# Altium schematic sheet ARDINO_UNO.SchDoc
size 500 x 350 mm; SheetNumber: 1; SheetTotal: 1
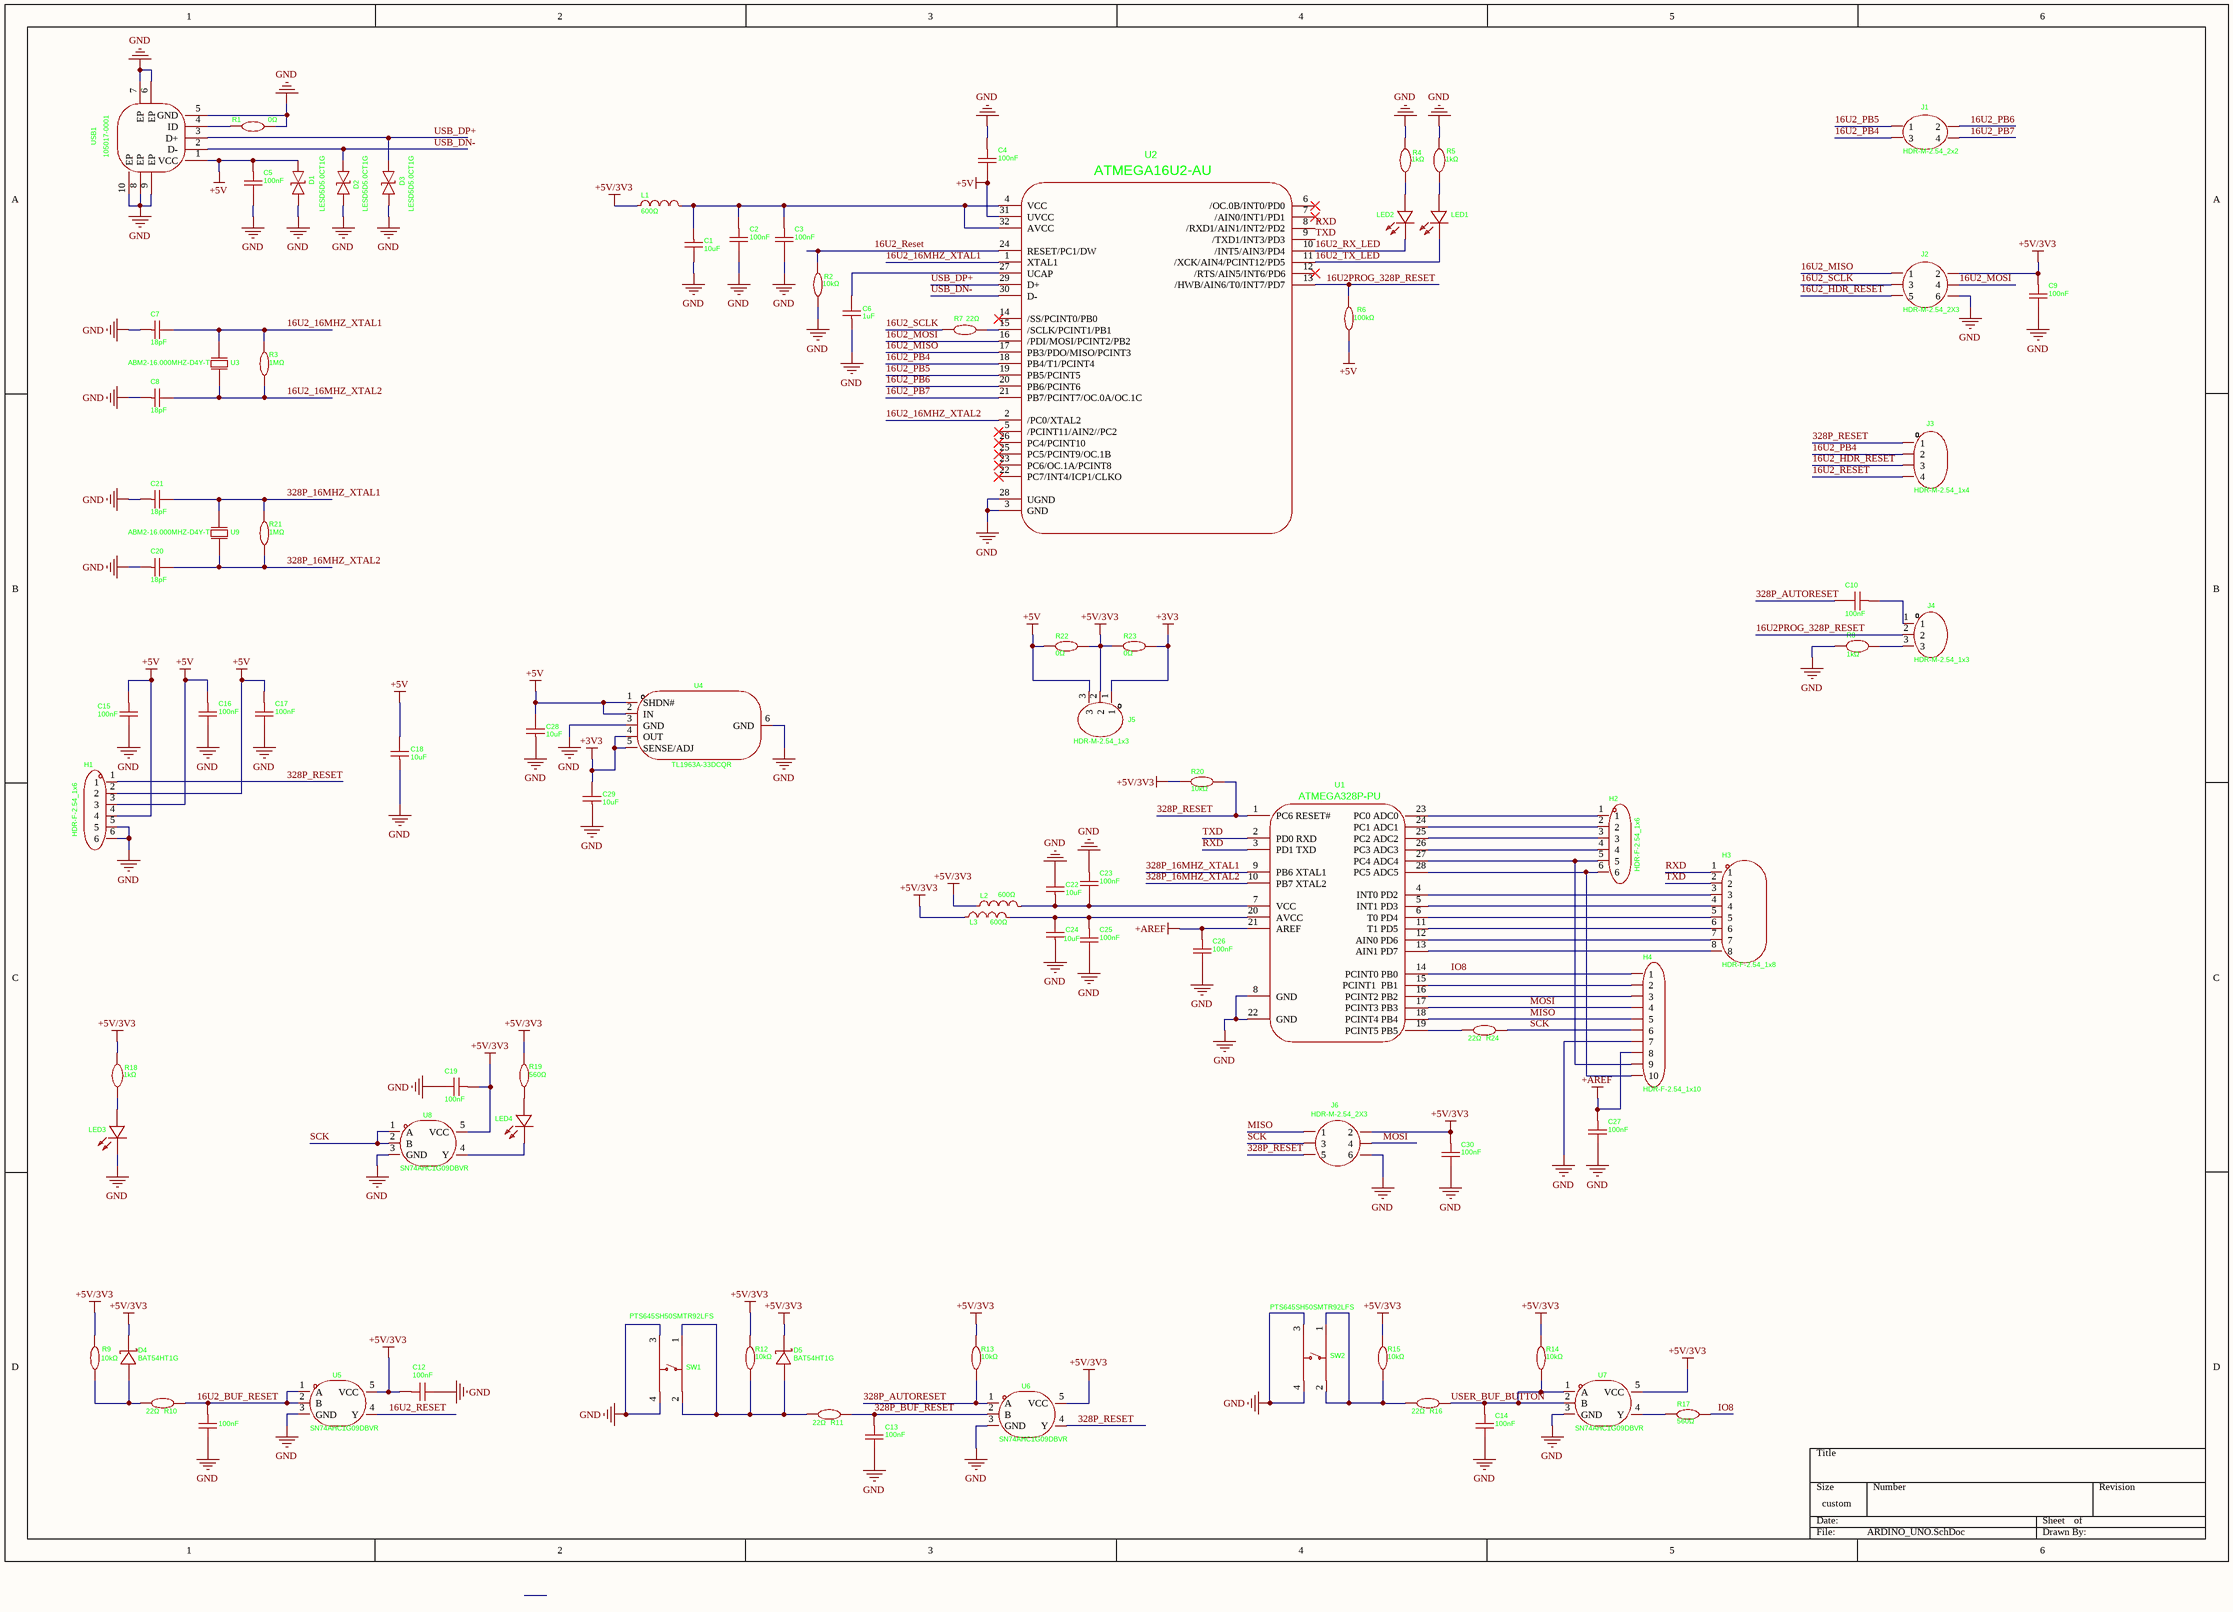
[diagram p0: ARDINO_UNO.SchDoc]

## Parts
?  100nF  [C0603-100nF]
C1  10uF  [C1206-10uF]
C2  100nF  [C0603-100nF]
C3  100nF  [C0603-100nF]
C4  100nF  [C0603-100nF]
C5  100nF  [C0603-100nF]
C6  1uF  [C0805-1uF]
C7  18pF  [C0402-18pF]
C8  18pF  [C0402-18pF]
C9  100nF  [C0603-100nF]
C10  100nF  [C0603-100nF]
C12  100nF  [C0603-100nF]
C13  100nF  [C0603-100nF]
C14  100nF  [C0603-100nF]
C15  100nF  [C0603-100nF]
C16  100nF  [C0603-100nF]
C17  100nF  [C0603-100nF]
C18  10uF  [C1206-10uF]
C19  100nF  [C0603-100nF]
C20  18pF  [C0402-18pF]
C21  18pF  [C0402-18pF]
C22  10uF  [C1206-10uF]
C23  100nF  [C0603-100nF]
C24  10uF  [C1206-10uF]
C25  100nF  [C0603-100nF]
C26  100nF  [C0603-100nF]
C27  100nF  [C0603-100nF]
C28  10uF  [C1206-10uF]
C29  10uF  [C1206-10uF]
C30  100nF  [C0603-100nF]
D1  LESD5D5.0CT1G  [SOD-523_L1.2-W0.8-LS1.6-BI]
D2  LESD5D5.0CT1G  [SOD-523_L1.2-W0.8-LS1.6-BI]
D3  LESD5D5.0CT1G  [SOD-523_L1.2-W0.8-LS1.6-BI]
D4  BAT54HT1G  [DIODE-SOD-323_L1.8-W1.3-LS2.5-RD]
D5  BAT54HT1G  [DIODE-SOD-323_L1.8-W1.3-LS2.5-RD]
H1  HDR-F-2.54_1x6  [HDR-TH_6P-P2.54-V-F]
H2  HDR-F-2.54_1x6  [HDR-TH_6P-P2.54-V-F]
H3  HDR-F-2.54_1x8  [HDR-TH_8P-P2.54-V_A2541HWV-8P]
H4  HDR-F-2.54_1x10  [HDR-TH_10P-P2.54-V-F]
J1  HDR-M-2.54_2x2  [HDR-TH_4P-P2.54-V-M-R2-C2-S2.54-1]
J2  HDR-M-2.54_2X3  [HDR-TH_6P-P2.54-V-M-R2-C3-S2.54-1]
J3  HDR-M-2.54_1x4  [HDR-TH_4P-P2.54-V-M]
J4  HDR-M-2.54_1x3  [HDR-TH_3P-P2.54-V-M-1]
J5  HDR-M-2.54_1x3  [HDR-TH_3P-P2.54-V-M-1]
J6  HDR-M-2.54_2X3  [HDR-TH_6P-P2.54-V-M-R2-C3-S2.54-1]
L1  600Ω  [L0805-600ohm]
L2  600Ω  [L0805-600ohm]
L3  600Ω  [L0805-600ohm]
LED1  KT-0805G  [LED0805-R-RD]  (value not drawn)
LED2  KT-0805G  [LED0805-R-RD]  (value not drawn)
LED3  KT-0805G  [LED0805-R-RD]  (value not drawn)
LED4  KT-0805G  [LED0805-R-RD]  (value not drawn)
R1  0Ω  [R0402-0 ohm]
R2  10kΩ  [R0402-10Kohm]
R3  1MΩ  [R0402-1M ohm]
R4  1kΩ  [R0805-1kohm]
R5  1kΩ  [R0805-1kohm]
R6  100kΩ  [R0805-100kohm]
R7  22Ω  [R0402-22 OHM]
R8  1kΩ  [R0805-1kohm]
R9  10kΩ  [R0402-10Kohm]
R10  22Ω  [R0402-22 OHM]
R11  22Ω  [R0402-22 OHM]
R12  10kΩ  [R0402-10Kohm]
R13  10kΩ  [R0402-10Kohm]
R14  10kΩ  [R0402-10Kohm]
R15  10kΩ  [R0402-10Kohm]
R16  22Ω  [R0402-22 OHM]
R17  560Ω  [R0402-560 OHM]
R18  1kΩ  [R0805-1kohm]
R19  560Ω  [R0402-560 OHM]
R20  10kΩ  [R0402-10Kohm]
R21  1MΩ  [R0402-1M ohm]
R22  0Ω  [R0402-0 ohm]
R23  0Ω  [R0402-0 ohm]
R24  22Ω  [R0402-22 OHM]
SW1  PTS645SH50SMTR92LFS  [KEY-SMD_4P-L6.0-W6.0-P4.50-LS9.0]
SW2  PTS645SH50SMTR92LFS  [KEY-SMD_4P-L6.0-W6.0-P4.50-LS9.0]
U1  ATMEGA328P-PU  [DIP-28_L34.6-W7.3-P2.54-LS10.2-BL]
U2  ATMEGA16U2-AU  [TQFP-32_L7.0-W7.0-P0.80-LS9.0-TL]
U3  ABM2-16.000MHZ-D4Y-T  [CRYSTAL-SMD_L8.0-W4.5]
U4  TL1963A-33DCQR  [SOT-223-6_L6.5-W3.5-P1.27-LS7.0-BR]
U5  SN74AHC1G09DBVR  [SOT-23-5_L2.9-W1.6-P0.95-LS2.8-BL]
U6  SN74AHC1G09DBVR  [SOT-23-5_L2.9-W1.6-P0.95-LS2.8-BL]
U7  SN74AHC1G09DBVR  [SOT-23-5_L2.9-W1.6-P0.95-LS2.8-BL]
U8  SN74AHC1G09DBVR  [SOT-23-5_L2.9-W1.6-P0.95-LS2.8-BL]
U9  ABM2-16.000MHZ-D4Y-T  [CRYSTAL-SMD_L8.0-W4.5]
USB1  105017-0001  [MICRO-USB-SMD_105017-0001]

## Nets
+3V3: C29.2 J5.1 R23.2 U4.4(OUT) U4.5(SENSE/ADJ)
+5V: C4.1 C5.2 C15.2 C16.2 C17.2 C18.2 C28.2 D1.2 H1.2 H1.3 H1.4 J5.3 R6.1 R22.1 U2.31(UVCC) U4.1(SHDN#) U4.2(IN) USB1.1(VCC)
+5V/3V3: C9.2 C12.2 C19.2 C30.2 D4.1(K) D5.1(K) J2.2 J5.2 J6.2 L1.1 L2.1 L3.1 R9.1 R12.2 R13.2 R14.2 R15.1 R18.2 R19.2 R20.2 R22.2 R23.1 U5.5(VCC) U6.5(VCC) U7.5(VCC) U8.5(VCC)
+AREF: C26.2 C27.2 H4.8 U1.21(AREF)
GND: ?.1 C1.2 C2.1 C3.1 C4.2 C5.1 C6.1 C7.1 C8.1 C9.1 C12.1 C13.1 C14.1 C15.1 C16.1 C17.1 C18.1 C19.1 C20.1 C21.1 C22.2 C23.2 C24.1 C25.1 C26.1 C27.1 C28.1 C29.1 C30.1 D1.1 D2.1 D3.1 H1.5 H1.6 H4.7 J2.6 J6.6 LED3.2(K) R1.2 R2.1 R4.2 R5.2 R8.1 SW1.3 SW1.4 SW2.3 SW2.4 U1.8(GND) U1.22(GND) U2.3(GND) U2.28(UGND) U4.3(GND) U4.6(GND) U5.3(GND) U6.3(GND) U7.3(GND) U8.3(GND) USB1.5(GND) USB1.6(EP) USB1.7(EP) USB1.8(EP) USB1.9(EP) USB1.10(EP)
16U2_16MHZ_XTAL1: C7.2 R3.2 U2.1(XTAL1) U3.2(OSC2)
16U2_16MHZ_XTAL2: C8.2 R3.1 U2.2(/PC0/XTAL2) U3.1(OSC1)
16U2_BUF_RESET: ?.2 R10.2 U5.1(A) U5.2(B)
16U2_HDR_RESET: J2.5 J3.3
16U2_MISO: J2.1 U2.17(PB3/PDO/MISO/PCINT3)
16U2_MOSI: J2.4 U2.16(/PDI/MOSI/PCINT2/PB2)
16U2_PB4: J1.3 J3.2 U2.18(PB4/T1/PCINT4)
16U2_PB5: J1.1 U2.19(PB5/PCINT5)
16U2_PB6: J1.2 U2.20(PB6/PCINT6)
16U2_PB7: J1.4 U2.21(PB7/PCINT7/OC.0A/OC.1C)
16U2_Reset: J3.4 R2.2 U2.24(RESET/PC1/DW) U5.4(Y)
16U2_RX_LED: LED2.2(K) U2.10(/INT5/AIN3/PD4)
16U2_SCLK: J2.3 R7.1
16U2_TX_LED: LED1.2(K) U2.11(/XCK/AIN4/PCINT12/PD5)
16U2PROG_328P_RESET: J4.2 R6.2 U2.13(/HWB/AIN6/T0/INT7/PD7)
328P_16MHZ_XTAL1: C21.2 R21.2 U1.9(PB6_XTAL1) U9.2(OSC2)
328P_16MHZ_XTAL2: C20.2 R21.1 U1.10(PB7_XTAL2) U9.1(OSC1)
328P_AUTORESET: C10.1 R13.1 U6.1(A)
328P_BUF_RESET: C13.2 R11.2 U6.2(B)
328P_RESET: H1.1 J3.1 J6.5 R20.1 U1.1(PC6_RESET#) U6.4(Y)
IO8: H4.1 R17.2 U1.14(PCINT0_PB0)
MISO: H4.5 J6.1 U1.18(PCINT4_PB4)
MOSI: H4.4 J6.4 U1.17(PCINT3_PB3)
RXD: H3.1 U1.3(PD1_TXD) U2.8(/RXD1/AIN1/INT2/PD2)
SCK: H4.6 J6.3 R24.2 U8.1(A) U8.2(B)
TXD: H3.2 U1.2(PD0_RXD) U2.9(/TXD1/INT3/PD3)
USB_DN-: D2.2 U2.30(D-) USB1.2(D-)
USB_DP+: D3.2 U2.29(D+) USB1.3(D+)
USER_BUF_BUTTON: C14.2 R14.1 R16.2 U7.1(A) U7.2(B)
NetC1_1: C1.1 C2.2 C3.2 L1.2 U2.4(VCC) U2.32(AVCC)
NetC6_2: C6.2 U2.27(UCAP)
NetC10_2: C10.2 J4.1
NetC22_1: C22.1 C23.1 L2.2 U1.7(VCC)
NetC24_2: C24.2 C25.2 L3.2 U1.20(AVCC)
NetD4_2: D4.2(A) R9.2 R10.1
NetD5_2: D5.2(A) R11.1 R12.1 SW1.1 SW1.2
NetH2_1: H2.1 U1.23(PC0_ADC0)
NetH2_2: H2.2 U1.24(PC1_ADC1)
NetH2_3: H2.3 U1.25(PC2_ADC2)
NetH2_4: H2.4 U1.26(PC3_ADC3)
NetH2_5: H2.5 H4.9 U1.27(PC4_ADC4)
NetH2_6: H2.6 H4.10 U1.28(PC5_ADC5)
NetH3_3: H3.3 U1.4(INT0_PD2)
NetH3_4: H3.4 U1.5(INT1_PD3)
NetH3_5: H3.5 U1.6(T0_PD4)
NetH3_6: H3.6 U1.11(T1_PD5)
NetH3_7: H3.7 U1.12(AIN0_PD6)
NetH3_8: H3.8 U1.13(AIN1_PD7)
NetH4_2: H4.2 U1.15(PCINT1__PB1)
NetH4_3: H4.3 U1.16(PCINT2_PB2)
NetJ4_3: J4.3 R8.2
NetLED1_1: LED1.1(A) R5.1
NetLED2_1: LED2.1(A) R4.1
NetLED3_1: LED3.1(A) R18.1
NetLED4_1: LED4.1(A) R19.1
NetLED4_2: LED4.2(K) U8.4(Y)
NetR1_1: R1.1 USB1.4(ID)
NetR7_2: R7.2 U2.15(/SCLK/PCINT1/PB1)
NetR15_2: R15.2 R16.1 SW2.1 SW2.2
NetR17_1: R17.1 U7.4(Y)
NetR24_1: R24.1 U1.19(PCINT5_PB5)

Not connected (* = marked no-connect by the designer): U2 5(/PCINT11/AIN2//PC2)* 6(/OC.0B/INT0/PD0)* 7(/AIN0/INT1/PD1)* 12(/RTS/AIN5/INT6/PD6)* 14(/SS/PCINT0/PB0)* 22(PC7/INT4/ICP1/CLKO)* 23(PC6/OC.1A/PCINT8)* 25(PC5/PCINT9/OC.1B)* 26(PC4/PCINT10)*

## Library data of the parts
? C2-C5 C9 C10 C12-C17 C19 C23 C25-C27 C30 = CC0603KRX7R9BB104: 50V 100nF X7R ±10% 0603 Multilayer Ceramic Capacitors MLCC - SMD/SMT ROHS; Manufacturer: YAGEO(国巨); Add into BOM: yes; Symbol: CC0603KRX7R9BB104; Device: CC0603KRX7R9BB104; LCSC Part Name: 100nF ±10% 50V; Supplier Part: C14663; Manufacturer Part: CC0603KRX7R9BB104; Supplier Footprint: 0603; JLCPCB Part Class: Basic Part; Datasheet: https://atta.szlcsc.com/upload/public/pdf/source/20180910/C282072_33301C7F631E79921B82A8DAC6BCC5B3.pdf; Supplier: LCSC; Convert to PCB: yes; Value: 100nF; Tolerance: ±10%
C1 C18 C22 C24 C28 C29 = CL31A106KBHNNNE: 50V 10uF X5R ±10% 1206 Multilayer Ceramic Capacitors MLCC - SMD/SMT ROHS; Manufacturer: SAMSUNG(三星); Add into BOM: yes; Symbol: CL31A106KBHNNNE; Device: CL31A106KBHNNNE; LCSC Part Name: 10uF ±10% 50V; Supplier Part: C13585; Manufacturer Part: CL31A106KBHNNNE; Supplier Footprint: 1206; JLCPCB Part Class: Basic Part; Datasheet: https://atta.szlcsc.com/upload/public/pdf/source/20160218/1457707763339.pdf; Supplier: LCSC; Convert to PCB: yes; Value: 10uF; Tolerance: ±10%
C6 = CL21B105KBFNNNE: 50V 1uF X7R ±10% 0805 Multilayer Ceramic Capacitors MLCC - SMD/SMT ROHS; Manufacturer: SAMSUNG(三星); Add into BOM: yes; Symbol: CL21B105KBFNNNE; Device: CL21B105KBFNNNE; LCSC Part Name: 1uF ±10% 50V; Supplier Part: C28323; Manufacturer Part: CL21B105KBFNNNE; Supplier Footprint: 0805; JLCPCB Part Class: Basic Part; Datasheet: https://atta.szlcsc.com/upload/public/pdf/source/20160218/1457707763339.pdf; Supplier: LCSC; Convert to PCB: yes; Value: 1uF; Tolerance: ±10%
C7 C8 C20 C21 = CC0402JRNPO9BN180: 50V 18pF NP0 ±5% 0402 Multilayer Ceramic Capacitors MLCC - SMD/SMT ROHS; Manufacturer: YAGEO(国巨); Add into BOM: yes; Symbol: CC0402JRNPO9BN180; Device: CC0402JRNPO9BN180; LCSC Part Name: 18pF ±5% 50V; Supplier Part: C106202; Manufacturer Part: CC0402JRNPO9BN180; Supplier Footprint: 0402; JLCPCB Part Class: Extended Part; Datasheet: https://atta.szlcsc.com/upload/public/pdf/source/20170505/1493957838062.pdf; Supplier: LCSC; Convert to PCB: yes; Value: 18pF; Tolerance: ±5%
D1-D3 = LESD5D5.0CT1G: 9.4A 18.6V 5.6V Bidirectional 5V SOD-523 ESD and Surge Protection (TVS/ESD) ROHS; Manufacturer: LRC(乐山无线电); Add into BOM: yes; Symbol: LESD5D5.0CT1G; Device: LESD5D5.0CT1G; LCSC Part Name: 双向ESD; Supplier Part: C383211; Manufacturer Part: LESD5D5.0CT1G; Supplier Footprint: SOD-523; JLCPCB Part Class: Extended Part; Datasheet: https://atta.szlcsc.com/upload/public/pdf/source/20190807/C383211_633DF4B4E2C161403226E5235FE33A1C.pdf; Supplier: LCSC; Convert to PCB: yes; polarity: Bidirectional; Reverse Stand-Off Voltage (Vrwm): 5V; Maximum Clamping Voltage: 18.6V; Peak Pulse Current (Ipp): 9.4A; Breakdown Voltage: 5.6V; Type: ESD
D4 D5 = BAT54HT1G: 30V 800mV@100mA 200mA SOD-323 Schottky Diodes ROHS; Manufacturer: onsemi(安森美); Add into BOM: yes; Reverse Leakage Current (Ir): 2uA@25V; Symbol: BAT54HT1G; Device: BAT54HT1G; LCSC Part Name: 电压:30V 电流:200mA; Supplier Part: C21107; Manufacturer Part: BAT54HT1G; Supplier Footprint: SOD-323; JLCPCB Part Class: Extended Part; Datasheet: https://atta.szlcsc.com/upload/public/pdf/source/20131023/1457706657764.pdf; Supplier: LCSC; Convert to PCB: yes; Forward Voltage (Vf@If): 800mV@100mA; Reverse Voltage (Vr): 30V; Rectified Current: 200mA
H1 H2 = HDR-F-2.54_1x6: 2.54mm Single Row 6P Direct Insert 1x6P Plugin,P=2.54mm Female Headers ROHS; Manufacturer: BOOMELE(博穆精密); Symbol: Header-Female-2.54_1x6; Device: 2.54-1*6P母; Add into BOM: yes; LCSC Part Name: 间距:2.54mm 1x6P 直插; Supplier Part: C40877; Manufacturer Part: 2.54-1*6P母; Supplier Footprint: 插件,P=2.54mm; JLCPCB Part Class: Extended Part; Datasheet: https://atta.szlcsc.com/upload/public/pdf/source/20210301/C2718488_F4427B881E42CAA8DDB0B1C12B3A522C.pdf; Supplier: LCSC; Convert to PCB: yes; Holes Structure: 1x6P; Pitch: 2.54mm; Row Spacing: -; Mounting Type: Straight; Number of Rows: Plugin; Number of Holes: 6P; Insulation Height: -; Contact Material: -; Contact Plating: -
H3 = A2541HWV-8P: 2.54mm 3A Single Row Gold -40℃~+105℃ 250V 8P Brass Direct Insert 1x8P Top 8.5mm Square Hole Plugin,P=2.54mm Female Headers ROHS; Manufacturer: CJT(长江连接器); Add into BOM: yes; PIN Length: 3.2mm; Symbol: A2541HWV-8P; Device: A2541HWV-8P; LCSC Part Name: 1x8P 间距:2.54mm 直插; Supplier Part: C225505; Manufacturer Part: A2541HWV-8P; Supplier Footprint: 插件,P=2.54mm; JLCPCB Part Class: Extended Part; Datasheet: https://atta.szlcsc.com/upload/public/pdf/source/20180724/C239359_48B1BC0CA1B4E4396A63955AAFD15564.pdf; Supplier: LCSC; Convert to PCB: yes; Holes Structure: 1x8P; Pitch: 2.54mm; Row Spacing: -; Circular Hole / Square Hole: Square Hole; Mounting Type: Direct Insert; Number of Rows: Single Row; Number of Positions: 8P; Current Rating: 3A; Voltage Rating (Max): 250V; Holes Direction: Top; Insulation Height: 8.5mm; Contact Material: Brass; Contact Plating: Gold; Operating Temperature: -40℃~+105℃
H4 = 2.54-1*10P母: 2.54mm Single Row 10P Direct Insert 1x10P Plugin,P=2.54mm Female Headers ROHS; Manufacturer: BOOMELE(博穆精密); Symbol: Header-Female-2.54_1x10; Add into BOM: yes; Device: 2.54-1*10P母; LCSC Part Name: 间距:2.54mm 1x10P 直插; Supplier Part: C35445; Manufacturer Part: 2.54-1*10P母; Supplier Footprint: 插件,P=2.54mm; JLCPCB Part Class: Extended Part; Datasheet: https://atta.szlcsc.com/upload/public/pdf/source/20200813/C35445_A4147CED0A1C9075722E373C7771E928.pdf; Supplier: LCSC; Convert to PCB: yes; Holes Structure: 1x10P; Pitch: 2.54mm; Row Spacing: -; Mounting Type: Straight; Number of Rows: Plugin; Number of Holes: 10P; Insulation Height: -; Contact Material: -; Contact Plating: -
J1 = 2.54-2*2P针: Straight 4P 2.54mm Double Row Black 2.54mm Plugin,P=2.54mm Pin Headers ROHS; Manufacturer: BOOMELE(博穆精密); Symbol: Header-Male-2.54_2x2; Add into BOM: yes; Device: 2.54-2*2P针; LCSC Part Name: 间距:2.54mm 直插; Supplier Part: C66690; Manufacturer Part: 2.54-2*2P针; Supplier Footprint: 插件,P=2.54mm; JLCPCB Part Class: Extended Part; Datasheet: https://atta.szlcsc.com/upload/public/pdf/source/20221201/C605E3BE9C0F7226363017EFD1BDE852.pdf; Supplier: LCSC; Convert to PCB: yes; Pin Structure: -; Pitch: 2.54mm; Row Spacing: 2.54mm; Circluar Pins/Square Pins: -; Mounting Type: Straight; Number of Rows: Double Row; Number of Pins: 4P; Current Rating: -; Voltage Rating (Max): -; Length of Mating Pin: -; Insulation Height: -; Contact Material: -; Contact Plating: -; Color: Black
J2 J6 = 2.54-2*3P针: Straight 6P 2.54mm Double Row Black Plugin,P=2.54mm Pin Headers ROHS; Manufacturer: BOOMELE(博穆精密); Symbol: Header-Male-2.54_2x3; Add into BOM: yes; Device: 2.54-2*3P针; LCSC Part Name: 间距:2.54mm 直插; Supplier Part: C65114; Manufacturer Part: 2.54-2*3P针; Supplier Footprint: 插件,P=2.54mm; JLCPCB Part Class: Extended Part; Supplier: LCSC; Convert to PCB: yes; Pin Structure: -; Pitch: 2.54mm; Row Spacing: -; Circluar Pins/Square Pins: -; Mounting Type: Straight; Number of Rows: Double Row; Number of Pins: 6P; Current Rating: -; Voltage Rating (Max): -; Length of Mating Pin: -; Insulation Height: -; Contact Material: -; Contact Plating: -; Color: Black
J3 = HDR-M-2.54_1x4: Straight 2.54mm 4P 6mm -40℃~+105℃ 3mm 2.54mm Single Row Black Brass 1x4P Plugin,P=2.54mm Pin Headers ROHS; Manufacturer: Ckmtw(灿科盟); Symbol: Header-Male-2.54_1x4; Device: B-2100S04P-A110; Add into BOM: yes; LCSC Part Name: 1x4P 间距:2.54mm 直插; Supplier Part: C124378; Manufacturer Part: B-2100S04P-A110; Supplier Footprint: 插件,P=2.54mm; JLCPCB Part Class: Extended Part; Datasheet: https://atta.szlcsc.com/upload/public/pdf/source/20170821/C124381_1503303309126901535.pdf; Supplier: LCSC; Convert to PCB: yes; Pin Structure: 1x4P; Pitch: 2.54mm; Row Spacing: -; Circluar Pins/Square Pins: -; Mounting Type: Straight; Number of Rows: Single Row; Number of Pins: 4P; Current Rating: -; Voltage Rating (Max): -; Length of Mating Pin: 6mm; Insulation Height: 2.54mm; Length of End Connection Pin: 3mm; Contact Material: Brass; Contact Plating: -; Operating Temperature: -40℃~+105℃; Color: Black
J4 J5 = HDR-M-2.54_1x3: Tin 3A Straight Policy 2.54mm 3P -65℃~+125℃ 2.54mm Single Row Black Phosphor Bronze Plugin,P=2.54mm Pin Headers ROHS; Manufacturer: Amphenol; Symbol: 77311-102-03LF; Add into BOM: yes; Device: 77311-102-03LF; LCSC Part Name: 间距:2.54mm 方针 直插; Supplier Part: C180248; Manufacturer Part: 77311-102-03LF; Supplier Footprint: 插件,P=2.54mm; JLCPCB Part Class: Extended Part; Datasheet: https://atta.szlcsc.com/upload/public/pdf/source/20180628/C213450_5021AFFAB06BCF705334CA5527F304F1.pdf; Supplier: LCSC; Convert to PCB: yes; Pin Structure: -; Pitch: 2.54mm; Row Spacing: -; Circluar Pins/Square Pins: Policy; Mounting Type: Straight; Number of Rows: Single Row; Number of Pins: 3P; Current Rating: 3A; Voltage Rating (Max): -; Length of Mating Pin: -; Insulation Height: 2.54mm; Contact Material: Phosphor Bronze; Contact Plating: Tin; Operating Temperature: -65℃~+125℃; Color: Black
L1-L3 = MPZ2012S601AT000: 100mΩ ±25% 600Ω@100MHz 0805 Ferrite Beads ROHS; Manufacturer: TDK; Add into BOM: yes; Current Rating: 2A; Circuits: 1; Symbol: MPZ2012S601AT000; Device: MPZ2012S601AT000; LCSC Part Name: 单路 0805磁珠 阻抗600Ω@100MHz; Supplier Part: C21519; Manufacturer Part: MPZ2012S601AT000; Supplier Footprint: 0805; JLCPCB Part Class: Extended Part; Datasheet: https://atta.szlcsc.com/upload/public/pdf/source/20141219/1457707252380.pdf; Supplier: LCSC; Convert to PCB: yes; Impedance @ Frequency: 600Ω@100MHz; Tolerance: ±25%; DC Resistance: 100mΩ
LED1-LED4 = KT-0805G: Emerald 0805 LED Indication - Discrete ROHS; Manufacturer: KENTO; Symbol: 0805G (Green); Add into BOM: yes; Device: KT-0805G; LCSC Part Name: 0805 翠绿 高亮; Supplier Part: C2297; Manufacturer Part: KT-0805G; Supplier Footprint: 0805; JLCPCB Part Class: Basic Part; Datasheet: https://atta.szlcsc.com/upload/public/pdf/source/20170209/1486607340485.pdf; Supplier: LCSC; Convert to PCB: yes; Lamp Holder Type: -; Emitted Color: Emerald; Forward Voltage (VF): -; Power Dissipation: -; Forward Current: -; Dominant Wavelength: -; Peak Wavelength: -; Diode Configuration: -; Lens Color: -; Color Temperature: -; Luminous Intensity: -; Viewing Angle: -; Mounting Sytle: -; Operating Temperature: -
R1 R22 R23 = RC0402FR-070RL: 62.5mW Thick Film Resistors 50V ±1% 0Ω 0402 Chip Resistor - Surface Mount ROHS; Manufacturer: YAGEO(国巨); Add into BOM: yes; Symbol: RC0402FR-070RL; Device: RC0402FR-070RL; LCSC Part Name: 厚膜电阻 0Ω ±1% 62.5mW; Supplier Part: C106231; Manufacturer Part: RC0402FR-070RL; Supplier Footprint: 0402; JLCPCB Part Class: Extended Part; Datasheet: https://atta.szlcsc.com/upload/public/pdf/source/20180927/C295883_E8D83085EA81BD7DE0B2B681138C15EE.pdf; Supplier: LCSC; Convert to PCB: yes; Type: Thick Film Resistors; Value: 0Ω; Tolerance: ±1%; Temperature Coefficient: -; Operating Temperature Range: -55℃~+155℃
R2 R9 R12-R15 R20 = RC0402FR-0710KL: 62.5mW Thick Film Resistors 50V ±100ppm/℃ ±1% 10kΩ 0402 Chip Resistor - Surface Mount ROHS; Manufacturer: YAGEO(国巨); Add into BOM: yes; Symbol: RC0402FR-0710KL; Device: RC0402FR-0710KL; LCSC Part Name: 厚膜电阻 10kΩ ±1% 62.5mW; Supplier Part: C60490; Manufacturer Part: RC0402FR-0710KL; Supplier Footprint: 0402; JLCPCB Part Class: Extended Part; Datasheet: https://atta.szlcsc.com/upload/public/pdf/source/20170925/C131467_1506321478108990263.pdf; Supplier: LCSC; Convert to PCB: yes; Type: Thick Film Resistors; Value: 10kΩ; Tolerance: ±1%; Temperature Coefficient: ±100ppm/℃; Operating Temperature Range: -55℃~+155℃
R3 R21 = RC0402FR-071ML: 62.5mW Thick Film Resistors 50V ±100ppm/℃ ±1% 1MΩ 0402 Chip Resistor - Surface Mount ROHS; Manufacturer: YAGEO(国巨); Add into BOM: yes; Symbol: RC0402FR-071ML; Device: RC0402FR-071ML; LCSC Part Name: 厚膜电阻 1MΩ ±1% 62.5mW; Supplier Part: C138033; Manufacturer Part: RC0402FR-071ML; Supplier Footprint: 0402; JLCPCB Part Class: Extended Part; Datasheet: https://atta.szlcsc.com/upload/public/pdf/source/20181009/C309620_DA5935B6E1D48212CB7A533FE518B3C2.pdf; Supplier: LCSC; Convert to PCB: yes; Type: Thick Film Resistors; Value: 1MΩ; Tolerance: ±1%; Temperature Coefficient: ±100ppm/℃; Operating Temperature Range: -55℃~+155℃
R4 R5 R8 R18 = FRC0805J102 TS: 0.125W Thick Film Resistors 150V ±100ppm/℃ ±5% 1kΩ 0805 Chip Resistor - Surface Mount ROHS; Manufacturer: FOJAN(富捷); Add into BOM: yes; Symbol: FRC0805J102 TS; Device: FRC0805J102 TS; LCSC Part Name: 1kΩ ±5% 125mW 厚膜电阻; Supplier Part: C2907295; Manufacturer Part: FRC0805J102 TS; Supplier Footprint: 0805; JLCPCB Part Class: Extended Part; Datasheet: https://atta.szlcsc.com/upload/public/pdf/source/20211221/925EC7D7225764EE0046F22065062C87.pdf; Supplier: LCSC; Convert to PCB: yes; Type: Thick Film Resistors; Value: 1kΩ; Tolerance: ±5%; Temperature Coefficient: ±100ppm/℃; Operating Temperature Range: -55℃~+155℃
R6 = 0805W8F1003T5E_1: 0.125W Thick Film Resistors 150V ±100ppm/℃ ±1% 100kΩ 0805 Chip Resistor - Surface Mount ROHS; Manufacturer: UNI-ROYAL(厚声); Symbol: 0805W8F1003T5E_C149504; Add into BOM: yes; Device: 0805W8F1003T5E; LCSC Part Name: 100kΩ ±1% 125mW 厚膜电阻; Supplier Part: C149504; Manufacturer Part: 0805W8F1003T5E; Supplier Footprint: 0805; JLCPCB Part Class: Basic Part; Datasheet: https://atta.szlcsc.com/upload/public/pdf/source/20200306/C422600_1E6D84923E4A46A82E41ADD87F860B5C.pdf; Supplier: LCSC; Convert to PCB: yes; Type: Thick Film Resistors; Value: 100kΩ; Tolerance: ±1%; Temperature Coefficient: ±100ppm/℃; Operating Temperature Range: -55℃~+155℃
R7 R10 R11 R16 R24 = RC0402FR-0722RL: 62.5mW Thick Film Resistors 50V ±100ppm/℃ ±1% 22Ω 0402 Chip Resistor - Surface Mount ROHS; Manufacturer: YAGEO(国巨); Add into BOM: yes; Symbol: RC0402FR-0722RL; Device: RC0402FR-0722RL; LCSC Part Name: 厚膜电阻 22Ω ±1% 62.5mW; Supplier Part: C114765; Manufacturer Part: RC0402FR-0722RL; Supplier Footprint: 0402; JLCPCB Part Class: Extended Part; Datasheet: https://atta.szlcsc.com/upload/public/pdf/source/20180821/C275644_0D56F95EFF785E7D9A1FEF436B37DA78.pdf; Supplier: LCSC; Convert to PCB: yes; Type: Thick Film Resistors; Value: 22Ω; Tolerance: ±1%; Temperature Coefficient: ±100ppm/℃; Operating Temperature Range: -55℃~+155℃
R17 R19 = RC0402FR-07560RL: 62.5mW Thick Film Resistors 50V ±100ppm/℃ ±1% 560Ω 0402 Chip Resistor - Surface Mount ROHS; Manufacturer: YAGEO(国巨); Add into BOM: yes; Symbol: RC0402FR-07560RL; Device: RC0402FR-07560RL; LCSC Part Name: 厚膜电阻 560Ω ±1% 62.5mW; Supplier Part: C163460; Manufacturer Part: RC0402FR-07560RL; Supplier Footprint: 0402; JLCPCB Part Class: Extended Part; Datasheet: https://atta.szlcsc.com/upload/public/pdf/source/20181009/C309620_DA5935B6E1D48212CB7A533FE518B3C2.pdf; Supplier: LCSC; Convert to PCB: yes; Type: Thick Film Resistors; Value: 560Ω; Tolerance: ±1%; Temperature Coefficient: ±100ppm/℃; Operating Temperature Range: -55℃~+155℃
SW1 SW2 = PTS645SH50SMTR92LFS: 6mm 5mm Round Button 50mA Standing paste 6mm SPST 200gf 12V SMD,6x6mm Tactile Switches ROHS; Manufacturer: C&K; Add into BOM: yes; Pin Style: Gullwing; Symbol: PTS645SH50SMTR92LFS; Device: PTS645SH50SMTR92LFS; LCSC Part Name: 6*6*5mm 立贴 轻触开关; Supplier Part: C221869; Manufacturer Part: PTS645SH50SMTR92LFS; Supplier Footprint: SMD,6x6mm; JLCPCB Part Class: Extended Part; Datasheet: https://atta.szlcsc.com/upload/public/pdf/source/20190108/C285530_E89B379DE8DD14E424006A6061D0203A.pdf; Supplier: LCSC; Convert to PCB: yes; Circuit: SPST; Actuator Style: Round Button; Operating Force: 200gf; Mounting Style: Standing paste; Switch Length: 6mm; Switch Width: 6mm; Switch Height: 5mm; Contact Current: 50mA; Voltage Rating (DC): 12V; With Lamp: -; Mechanical Life: -; Operating Temperature: -40℃~+85℃
U1 = ATMEGA328P-PU: AVR 20MHz DIP-28-300mil Microcontrollers (MCU/MPU/SOC) ROHS; Manufacturer: MICROCHIP(美国微芯); Add into BOM: yes; Program Storage Size: 32KB; RAM Size: 2KB; GPIO Ports Number: 23; Operating Voltage Range: 1.8V~5.5V; Program Memory Type: FLASH; EEPROM: 1KB; ADC (Bit): 10bit; Peripheral/Function: WDT；PWM; Watchdog: 有; Symbol: ATMEGA328P-PU; Device: ATMEGA328P-PU; LCSC Part Name: 基于AVR增强型RISC架构的低功耗CMOS 8位微控制器 MSL=1; Supplier Part: C33901; Manufacturer Part: ATMEGA328P-PU; Supplier Footprint: DIP-28-300mil; JLCPCB Part Class: Extended Part; Datasheet: https://atta.szlcsc.com/upload/public/pdf/source/20150124/1457707257819.pdf; Supplier: LCSC; Convert to PCB: yes; CPU Core: AVR; CPU Maximum Speed: 20MHz; Operating Temperature Range: -40℃~+85℃; DAC (Bit): -; PWM (Bit): -; Universal Serial Bus: -; Internal Comparator: -; communication protocol: -; Real-Time Clock: -; Infrared Data Association: -; Low-Voltage Detect: 有; CCP Capture/Compare: -; Secure Digital Input and Output: -; Direct Memory Access: -; Internal Oscillator: 有
U2 = ATMEGA16U2-AU: AVR 16MHz TQFP-32(7x7) Microcontrollers (MCU/MPU/SOC) ROHS; Manufacturer: MICROCHIP(美国微芯); Add into BOM: yes; Program Storage Size: 16KB; RAM Size: 512Byte; GPIO Ports Number: 22; Operating Voltage Range: 2.7V~5.5V; Program Memory Type: FLASH; Universal Serial Bus: 有; Peripheral/Function: WDT；PWM; Symbol: ATMEGA16U2-AU; Device: ATMEGA16U2-AU; LCSC Part Name: ATMEGA16U2-AU; Supplier Part: C59019; Manufacturer Part: ATMEGA16U2-AU; Supplier Footprint: TQFP-32(7x7); JLCPCB Part Class: Extended Part; Datasheet: https://atta.szlcsc.com/upload/public/pdf/source/20150921/1457707392275.pdf; Supplier: LCSC; Convert to PCB: yes; CPU Core: AVR; CPU Maximum Speed: 16MHz; EEPROM: 512Byte; Operating Temperature Range: -40℃~+85℃; ADC (Bit): -; DAC (Bit): -; PWM (Bit): -; Internal Comparator: -; communication protocol: -; Watchdog: 有; Real-Time Clock: -; Infrared Data Association: -; Low-Voltage Detect: 有; CCP Capture/Compare: -; Secure Digital Input and Output: -; Direct Memory Access: -; Internal Oscillator: 有
U3 U9 = ABM2-16.000MHZ-D4Y-T: 16MHz 18pF ±30ppm ±30ppm SMD8045-2P Crystals ROHS; Manufacturer: ABRACON; Add into BOM: yes; Equivalent Series Resistance (ESR): 50Ω; Symbol: ABM2-16.000MHZ-D4Y-T; Device: ABM2-16.000MHZ-D4Y-T; LCSC Part Name: 16MHz ±30ppm 18pF; Supplier Part: C313031; Manufacturer Part: ABM2-16.000MHZ-D4Y-T; Supplier Footprint: SMD8045-2P; JLCPCB Part Class: Extended Part; Datasheet: https://atta.szlcsc.com/upload/public/pdf/source/20181218/C313047_B386BE91FC1AD190D494D32FAE513859.pdf; Supplier: LCSC; Convert to PCB: yes; Crystal Type: -; Value: 16MHz; Normal temperature Frequency Tolerance: ±30ppm; Frequency Stability: ±30ppm
U4 = TL1963A-33DCQR: 63dB@(120Hz) 1.5A Fixed 3.3V Positive electrode 20V SOT-223-6 Voltage Regulators - Linear, Low Drop Out (LDO) Regulators ROHS; Manufacturer: TI(德州仪器); Add into BOM: yes; Dropout Voltage: 550mV@(1.5A); standby current: 1mA; Number of Outputs: 1; Symbol: TL1963A-33DCQR; Device: TL1963A-33DCQR; LCSC Part Name: 具有反向电流和反向电压保护功能的 1.5A、20V 超低压降稳压器; Supplier Part: C2873060; Manufacturer Part: TL1963A-33DCQR; Supplier Footprint: SOT-223-6; JLCPCB Part Class: Extended Part; Datasheet: https://www.ti.com/cn/lit/gpn/tl1963a; Supplier: LCSC; Convert to PCB: yes; Output Type: Fixed; Maximum Input Voltage: 20V; Output Voltage: 3.3V; Output Current: 1.5A; Power Supply Rejection Ratio (PSRR): 63dB@(120Hz); Feature: 防静电保护；低ESR；Thermal Protection(TSD)；Overcurrent Protection(OCP)；带使能; Operating Temperature: -40℃~+125℃; Output Polarity: Positive electrode
U5-U8 = SN74AHC1G09DBVR: 2V~5.5V 1uA 1 7.5ns@5V,50pF AND Gate SOT-23-5 Logic Gates ROHS; Manufacturer: TI(德州仪器); Add into BOM: yes; Logic Gate Type: 与门; Number of Channels: 1; Sink Current: 8mA; High Level Range (VIH): 1.5V~3.85V; Low Level Range (VIL): 500mV~1.65V; Symbol: SN74AHC1G09DBVR; Device: SN74AHC1G09DBVR; LCSC Part Name: SN74AHC1G09DBVR; Supplier Part: C840099; Manufacturer Part: SN74AHC1G09DBVR; Supplier Footprint: SOT-23-5; JLCPCB Part Class: Extended Part; Datasheet: https://www.ti.com/cn/lit/gpn/sn74ahc1g09; Supplier: LCSC; Convert to PCB: yes; Supply Voltage: 2V~5.5V; Quiescent Current (Max): 1uA; Source Current: -; Series: 74AHCSeries; Propagation Delay Time: 7.5ns@5V,50pF; Operating Temperature: -55℃~+125℃
USB1 = 105017-0001: USB 2.0 1 Horizontal attachment 5P Female -30℃~+85℃ Micro-B SMD USB Connectors ROHS; Manufacturer: MOLEX; Device: 1050170001; Add into BOM: yes; Number of Ports: 1; Symbol: 105017-0001; LCSC Part Name: Micro-B 母 卧贴; Supplier Part: C136000; Manufacturer Part: 1050170001; Supplier Footprint: SMD; JLCPCB Part Class: Extended Part; Datasheet: https://atta.szlcsc.com/upload/public/pdf/source/20171113/C136000_15105610884381115465.pdf; Supplier: LCSC; Convert to PCB: yes; Connector Type: Micro-B; Standard: USB 2.0; Gender: Female; Number of Contacts: 5P; Mounting Style: 卧贴; Current Rating - Power (Max): -; Operating Temperature Range: -30℃~+85℃